# EAGLE design preamp (EAGLE 8.3.2)
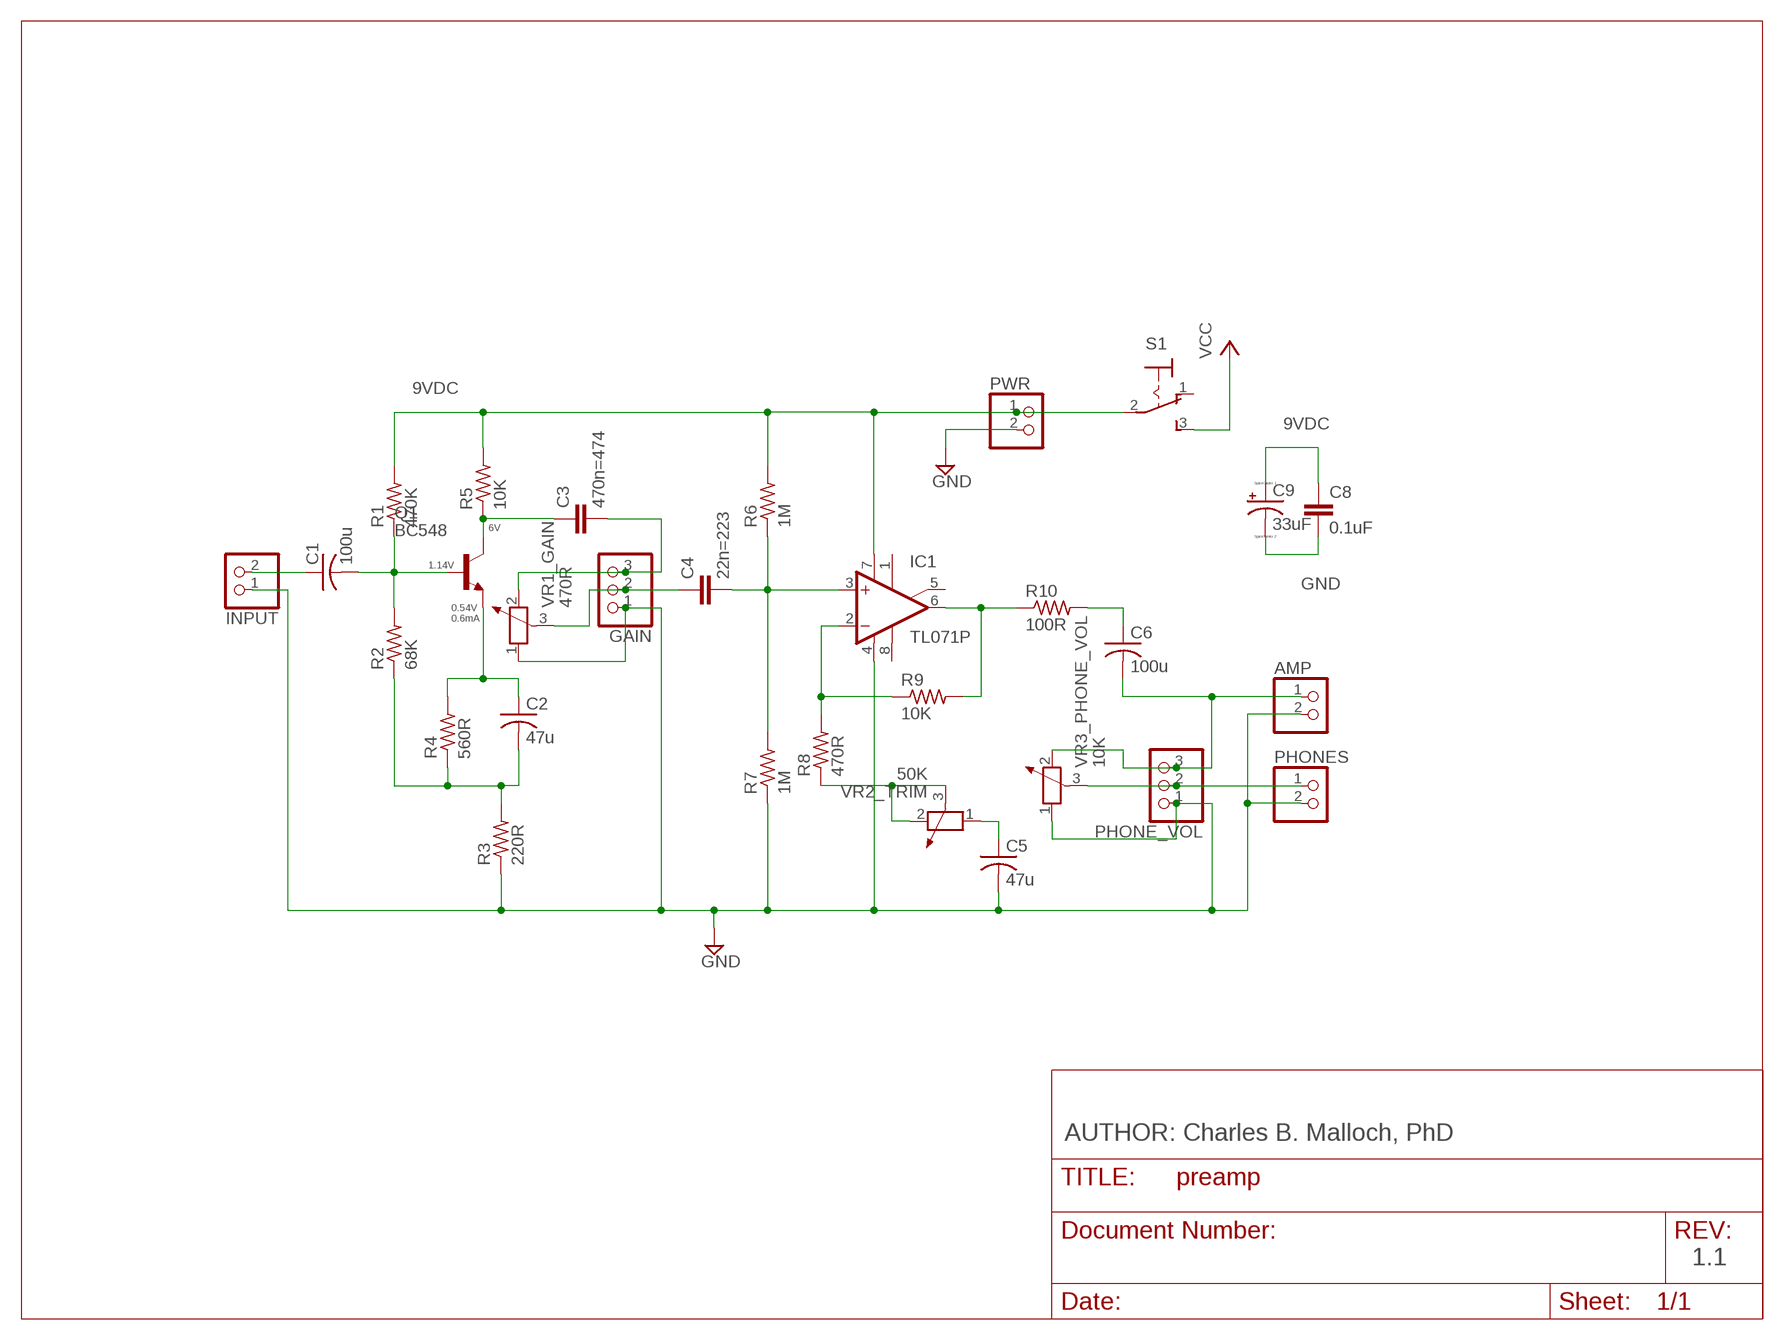
[diagram p0: schematic, sheet 1]

## Parts
AMP  PINHD-1X2  [1X02]
C1  100u  C-US025-040X050  [C025-040X050]
C2  47u  C-US025-040X050  [C025-040X050]
C3  470n=474  C-EU025-060X050  [C025-060X050]
C4  22n=223  C-EU025-060X050  [C025-060X050]
C5  47u  C-US025-040X050  [C025-040X050]
C6  100u  C-US025-040X050  [C025-040X050]
C8  0.1uF  C-EU025-030X050  [C025-030X050]
C9  33uF  CPOL-USE5-6  [E5-6]
GAIN  PINHD-1X3  [1X03]
IC1  TL071P  [DIL08]
INPUT  PINHD-1X2  [1X02]
PHONE_VOL  PINHD-1X3  [1X03]
PHONES  PINHD-1X2  [1X02]
PWR  PINHD-1X2  [1X02]
Q1  BC548  [TO92-EBC]
R1  470K  R-US_0204/7  [0204/7]
R2  68K  R-US_0204/7  [0204/7]
R3  220R  R-US_0204/7  [0204/7]
R4  560R  R-US_0204/7  [0204/7]
R5  10K  R-US_0204/7  [0204/7]
R6  1M  R-US_0204/7  [0204/7]
R7  1M  R-US_0204/7  [0204/7]
R8  470R  R-US_0204/7  [0204/7]
R9  10K  R-US_0204/7  [0204/7]
R10  100R  R-US_0204/7  [0204/7]
S1  320-916  [320-916]
VR1_GAIN  470R  POTENTIOMETER_PT-10  [PT-10]
VR2_TRIM  50K  POTENTIOMETER_PT-10  [PT-10]
VR3_PHONE_VOL  10K  POTENTIOMETER_PT-10  [PT-10]

## Nets
9VDC: C8.1 C9.+ IC1.7(V+) PWR.1 R1.2 R5.2 R6.2 S1.2(P)
BAT+: S1.3(S) ; supply symbol labelled VCC
GND: AMP.2 C5.2 C8.2 C9.- GAIN.1 IC1.4(V-) INPUT.1 PHONE_VOL.1 PHONES.2 PWR.2 R3.1 R7.1 VR1_GAIN.1 VR3_PHONE_VOL.1
N$1: C4.1 GAIN.2 VR1_GAIN.3
N$2: C1.1 INPUT.2
N$3: C1.2 Q1.B R1.1 R2.2
N$4: C3.2 GAIN.3 VR1_GAIN.2
N$5: PHONE_VOL.2 PHONES.1 VR3_PHONE_VOL.3
N$7: C3.1 Q1.C R5.1
N$8: C2.2 R2.1 R3.2 R4.1
N$9: C4.2 IC1.3(+IN) R6.1 R7.2
N$10: C2.1 Q1.E R4.2
N$11: IC1.6(OUT) R9.2 R10.1
N$12: IC1.2(-IN) R8.2 R9.1
N$13: R8.1 VR2_TRIM.2 VR2_TRIM.3
N$15: C5.1 VR2_TRIM.1
N$16: C6.1 R10.2
N$17: AMP.1 C6.2 PHONE_VOL.3 VR3_PHONE_VOL.2
Unconnected: IC1.1(ON1) IC1.5(ON2) IC1.8(OPT) S1.1(O)

## Notes on the sheet
- 6V
- 1.14V
- 0.54V
  0.6mA
- AUTHOR: Charles B. Malloch, PhD
- 1.1

## Library data of the parts
AMP INPUT PHONES PWR = pinhead:PINHD-1X2: PIN HEADER
C1 C2 C5 C6 = resistor:C-US: CAPACITOR, American symbol
C3 C4 = rcl:C-EU: CAPACITOR, European symbol
C8 = resistor:C-EU: CAPACITOR, European symbol
C9 = resistor:CPOL-US: POLARIZED CAPACITOR, American symbol
GAIN PHONE_VOL = pinhead:PINHD-1X3: PIN HEADER
IC1 = linear:TL071: OP AMP
Q1 = transistor-npn:BC548*: NPN Transistor
R1-R10 = resistor:R-US_: RESISTOR, American symbol
S1 = switch:320-916: TOGGLE SWITCH distributor RS Components
VR1_GAIN VR2_TRIM VR3_PHONE_VOL = rcl:POTENTIOMETER_: Potentiometer

## Board
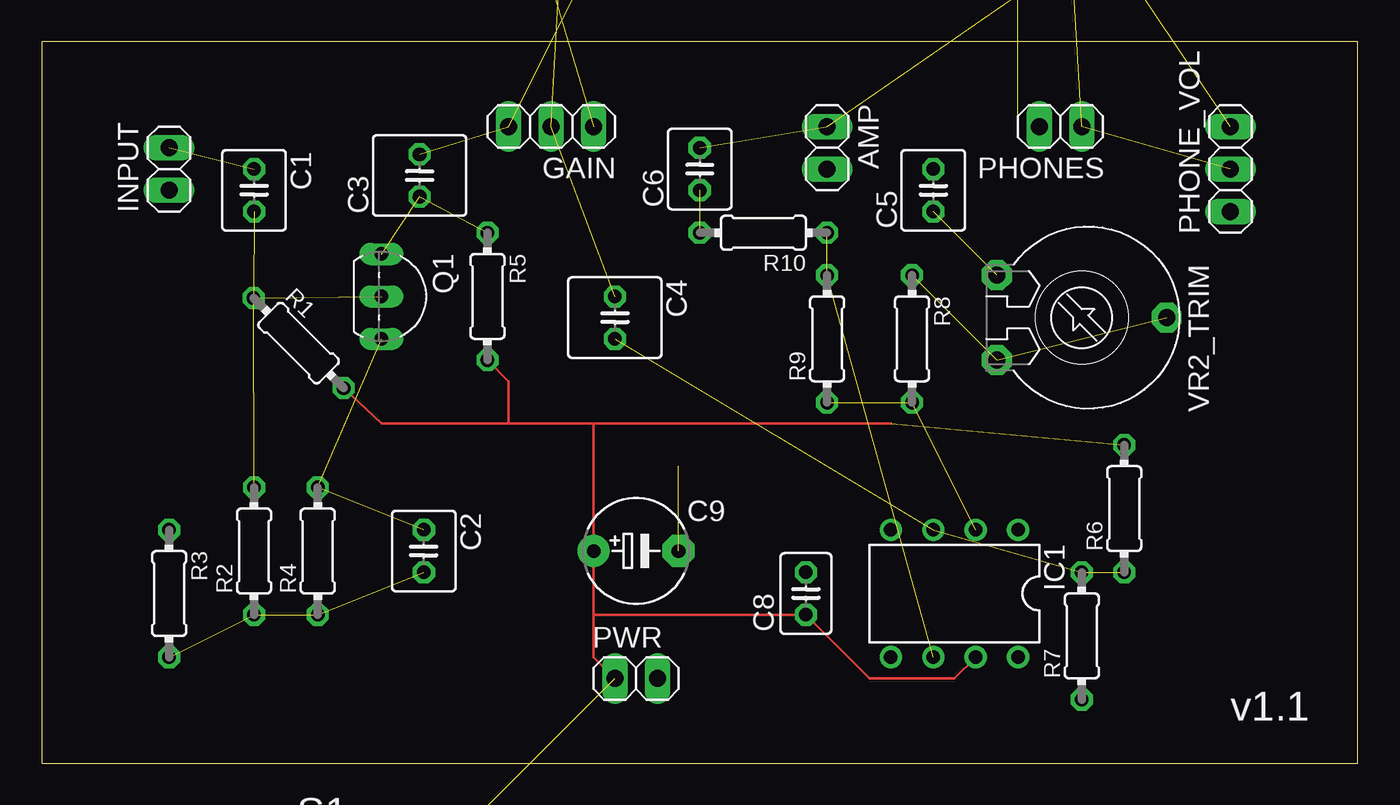
[diagram p1: board, top side]
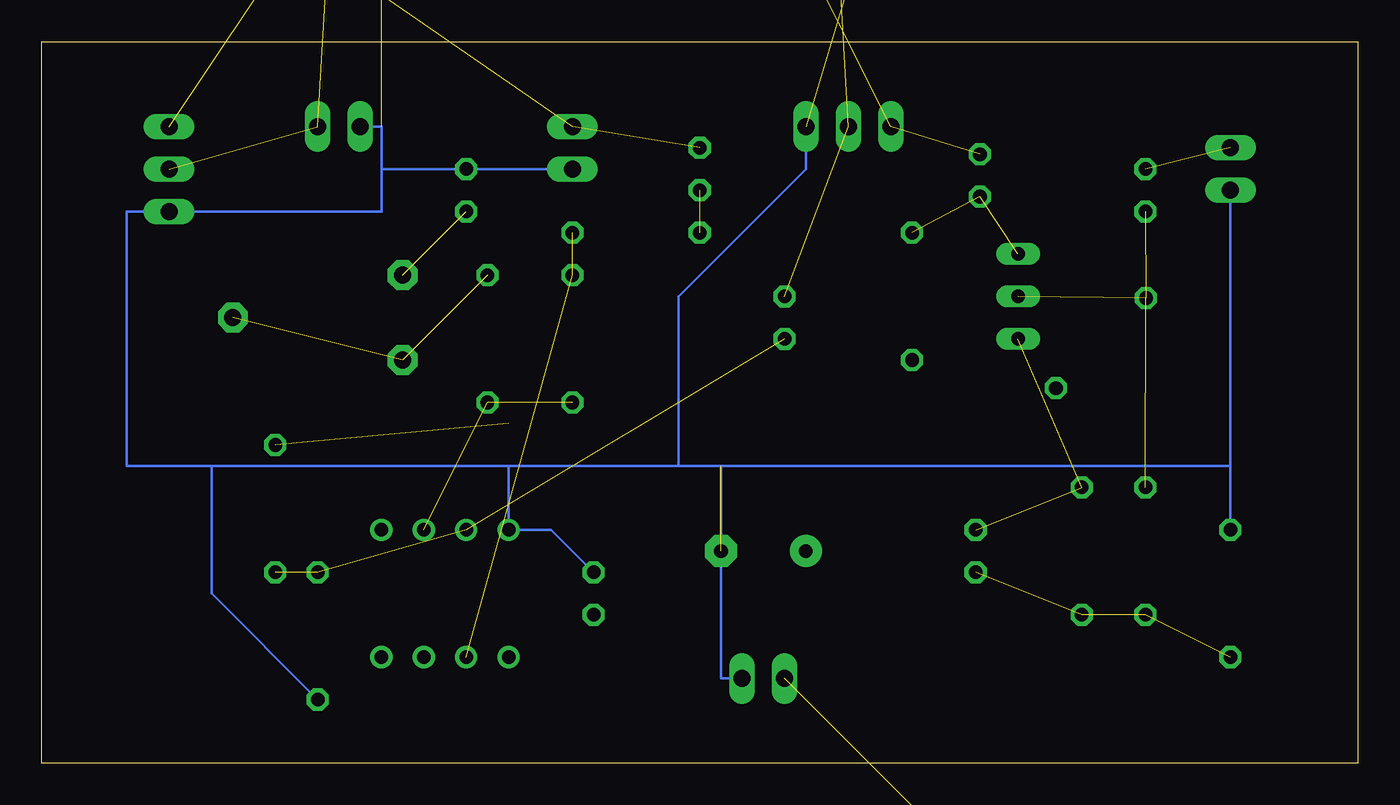
[diagram p2: board, bottom side, seen from below]

Size 78.74 x 43.18 mm. Coordinates in mm from the lower left corner, seen from the top.
Outline: 0,0 78.74,0 78.74,43.18 0,43.18 0,0
Copper layers (1*16): Top 0.035mm / dielectric 1.5mm / Bottom 0.035mm
Design rules "default": minimum track width 6mil, minimum drill 0.35mm, track to track 6mil, track to pad 6mil, pad to pad 6mil, via to via 6mil, smd to smd 6mil, copper to edge 40mil, drill to drill 6mil, minimum pad ring 10mil, minimum via ring 8mil, stop-mask expansion 4mil, vias tented up to drill 0mil, thermal gap 10mil

### Footprints (pad centres in the part's own frame; a part is rotated, then mirrored left to right if it is on the bottom)
1X02 = drill 1.016 long: 1 -1.27,0; 2 1.27,0
C025-040X050 = drill 0.813 octagon: 1 -1.27,0; 2 1.27,0
C025-060X050 = drill 0.813 octagon: 1 -1.27,0; 2 1.27,0
C025-030X050 = drill 0.813 octagon: 1 -1.27,0; 2 1.27,0
E5-6 = drill 0.813 pad 1.905: + -2.54,0 | drill 0.813 pad 1.905 octagon: - 2.54,0
1X03 = drill 1.016 long: 1 -2.54,0; 2 0,0; 3 2.54,0
DIL08 = drill 0.813 pad 1.27: 1 -3.81,-3.81; 2 -1.27,-3.81; 3 1.27,-3.81; 4 3.81,-3.81; 5 3.81,3.81; 6 1.27,3.81; 7 -1.27,3.81; 8 -3.81,3.81
TO92-EBC = drill 0.813 long: B 0,-1.27; C -2.54,-1.27; E 2.54,-1.27
0204/7 = drill 0.813 octagon: 1 -3.81,0; 2 3.81,0
320-916 = drill 2.007 long: 1 0,4.013; 2 0,0; 3 0,-4.013
PT-10 = drill 1.016 pad 1.778 octagon: 1 -2.54,-5.08; 2 2.54,-5.08; 3 0,5.08

### Placement (x,y rotation side)
AMP  46.99,36.83 270 top
C1  12.7,34.29 270 top
C2  22.86,12.7 270 top
C3  22.61,35.18 90 top
C4  34.29,26.67 270 top
C5  53.34,34.29 90 top
C6  39.37,35.56 90 top
C8  45.72,10.16 90 top
C9  35.56,12.7 0 top
GAIN  30.48,38.1 180 top
IC1  54.61,10.16 180 top
INPUT  7.62,35.56 90 top
PHONE_VOL  71.12,35.56 90 top
PHONES  60.96,38.1 180 top
PWR  35.56,5.08 0 top
Q1  21.59,27.94 270 top
R1  15.37,25.15 315 top
R2  12.7,12.7 90 top
R3  7.62,10.16 270 top
R4  16.51,12.7 90 top
R5  26.67,27.94 270 top
R6  64.77,15.24 90 top
R7  62.23,7.62 90 top
R8  52.07,25.4 270 top
R9  46.99,25.4 90 top
R10  43.18,31.75 180 top
S1  17.78,-11.43 0 top  (outside the outline)
VR1_GAIN  31.75,55.88 0 top  (outside the outline)
VR2_TRIM  62.23,26.67 270 top
VR3_PHONE_VOL  60.96,54.61 0 top  (outside the outline)

### Tracks (layer width: path | path; a pad name or v marks a point on that pad's centre or on a via)
9VDC  (2 unrouted)
  Top 0.152: 27.94,20.32 20.32,20.32 R1.2 | 33.02,20.32 27.94,20.32 | 33.02,20.32 50.8,20.32 | R5.2 27.94,22.86 27.94,20.32 | PWR.1 33.02,6.35 33.02,8.89 | 33.02,8.89 C9.+ 33.02,20.32 | 33.02,8.89 C8.1 49.53,5.08 54.61,5.08 IC1.7
GND  (3 unrouted)
  Bottom 0.152: 50.8,17.78 40.64,17.78 | 68.58,17.78 50.8,17.78 | 68.58,17.78 73.66,17.78 73.66,33.02 PHONE_VOL.1 58.42,33.02 58.42,35.56 | 38.1,17.78 7.62,17.78 | 38.1,17.78 40.64,17.78 | INPUT.1 7.62,17.78 | R3.1 7.62,17.78 | PHONES.2 58.42,38.1 58.42,35.56 | 58.42,35.56 C5.2 AMP.2 | GAIN.1 33.02,35.56 40.64,27.94 40.64,17.78 | PWR.2 38.1,5.08 38.1,17.78 | 50.8,17.78 IC1.4 48.26,13.97 C8.2 | R7.1 68.58,10.16 68.58,17.78
N$1  (2 unrouted)
N$2  (1 unrouted)
N$3  (3 unrouted)
N$4  (2 unrouted)
N$5  (2 unrouted)
N$7  (2 unrouted)
N$8  (3 unrouted)
N$9  (3 unrouted)
N$10  (2 unrouted)
N$11  (2 unrouted)
N$12  (2 unrouted)
N$13  (2 unrouted)
N$15  (1 unrouted)
N$16  (1 unrouted)
N$17  (3 unrouted)

### Text on the board
tNames: v1.1